# Altium schematic sheet projet_pcb_nucleo_g431.SchDoc
size A2
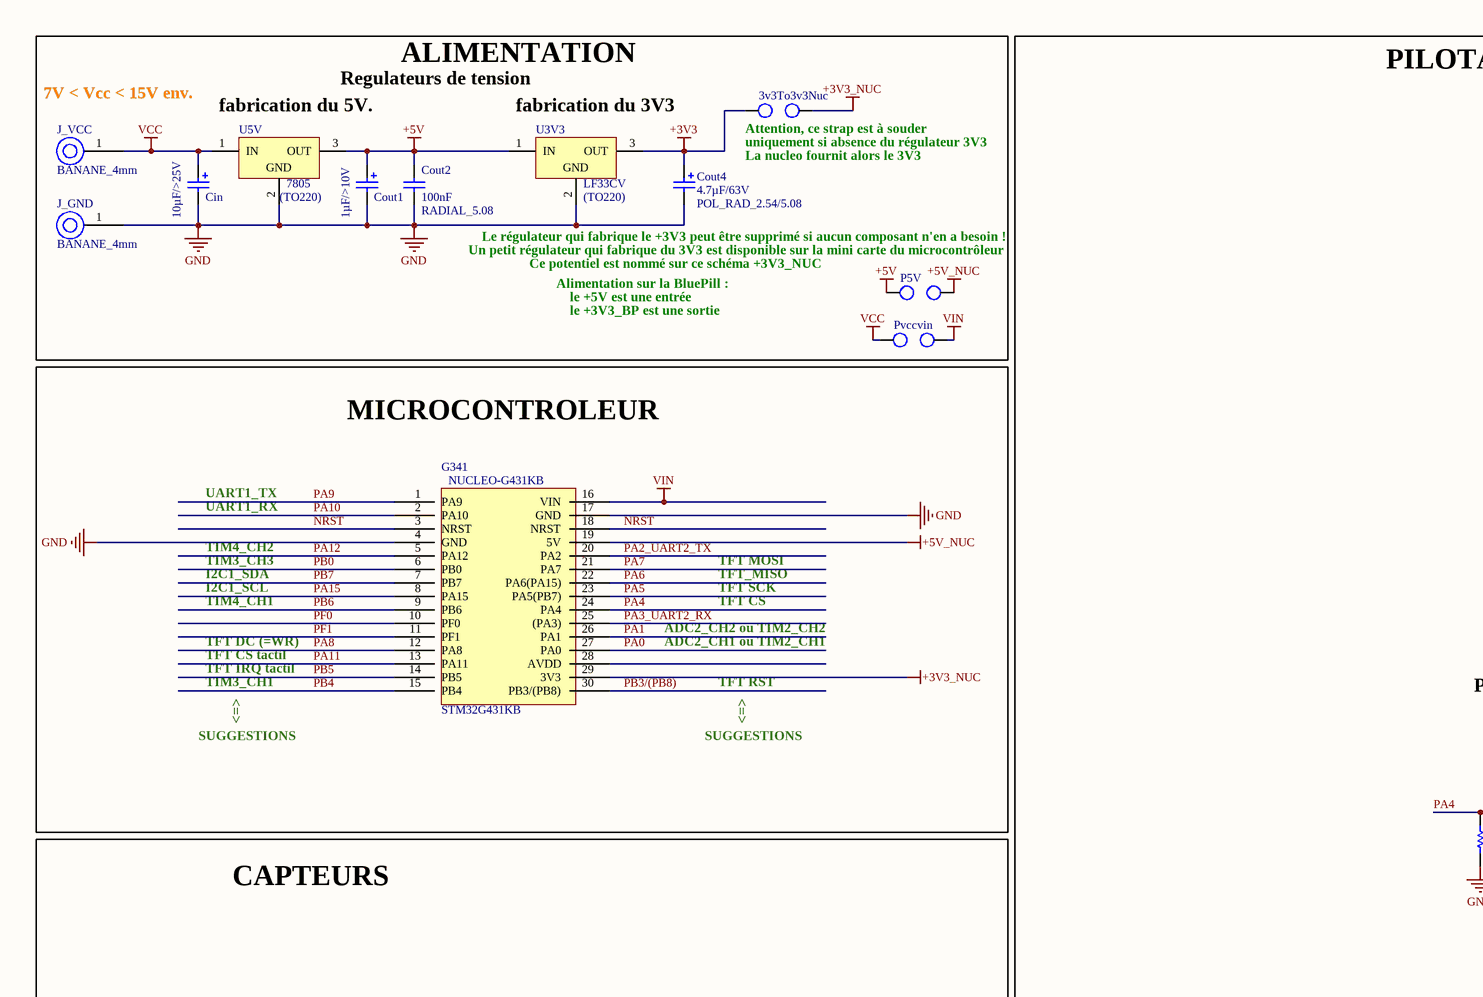
[diagram p0: projet_pcb_nucleo_g431.SchDoc, left]
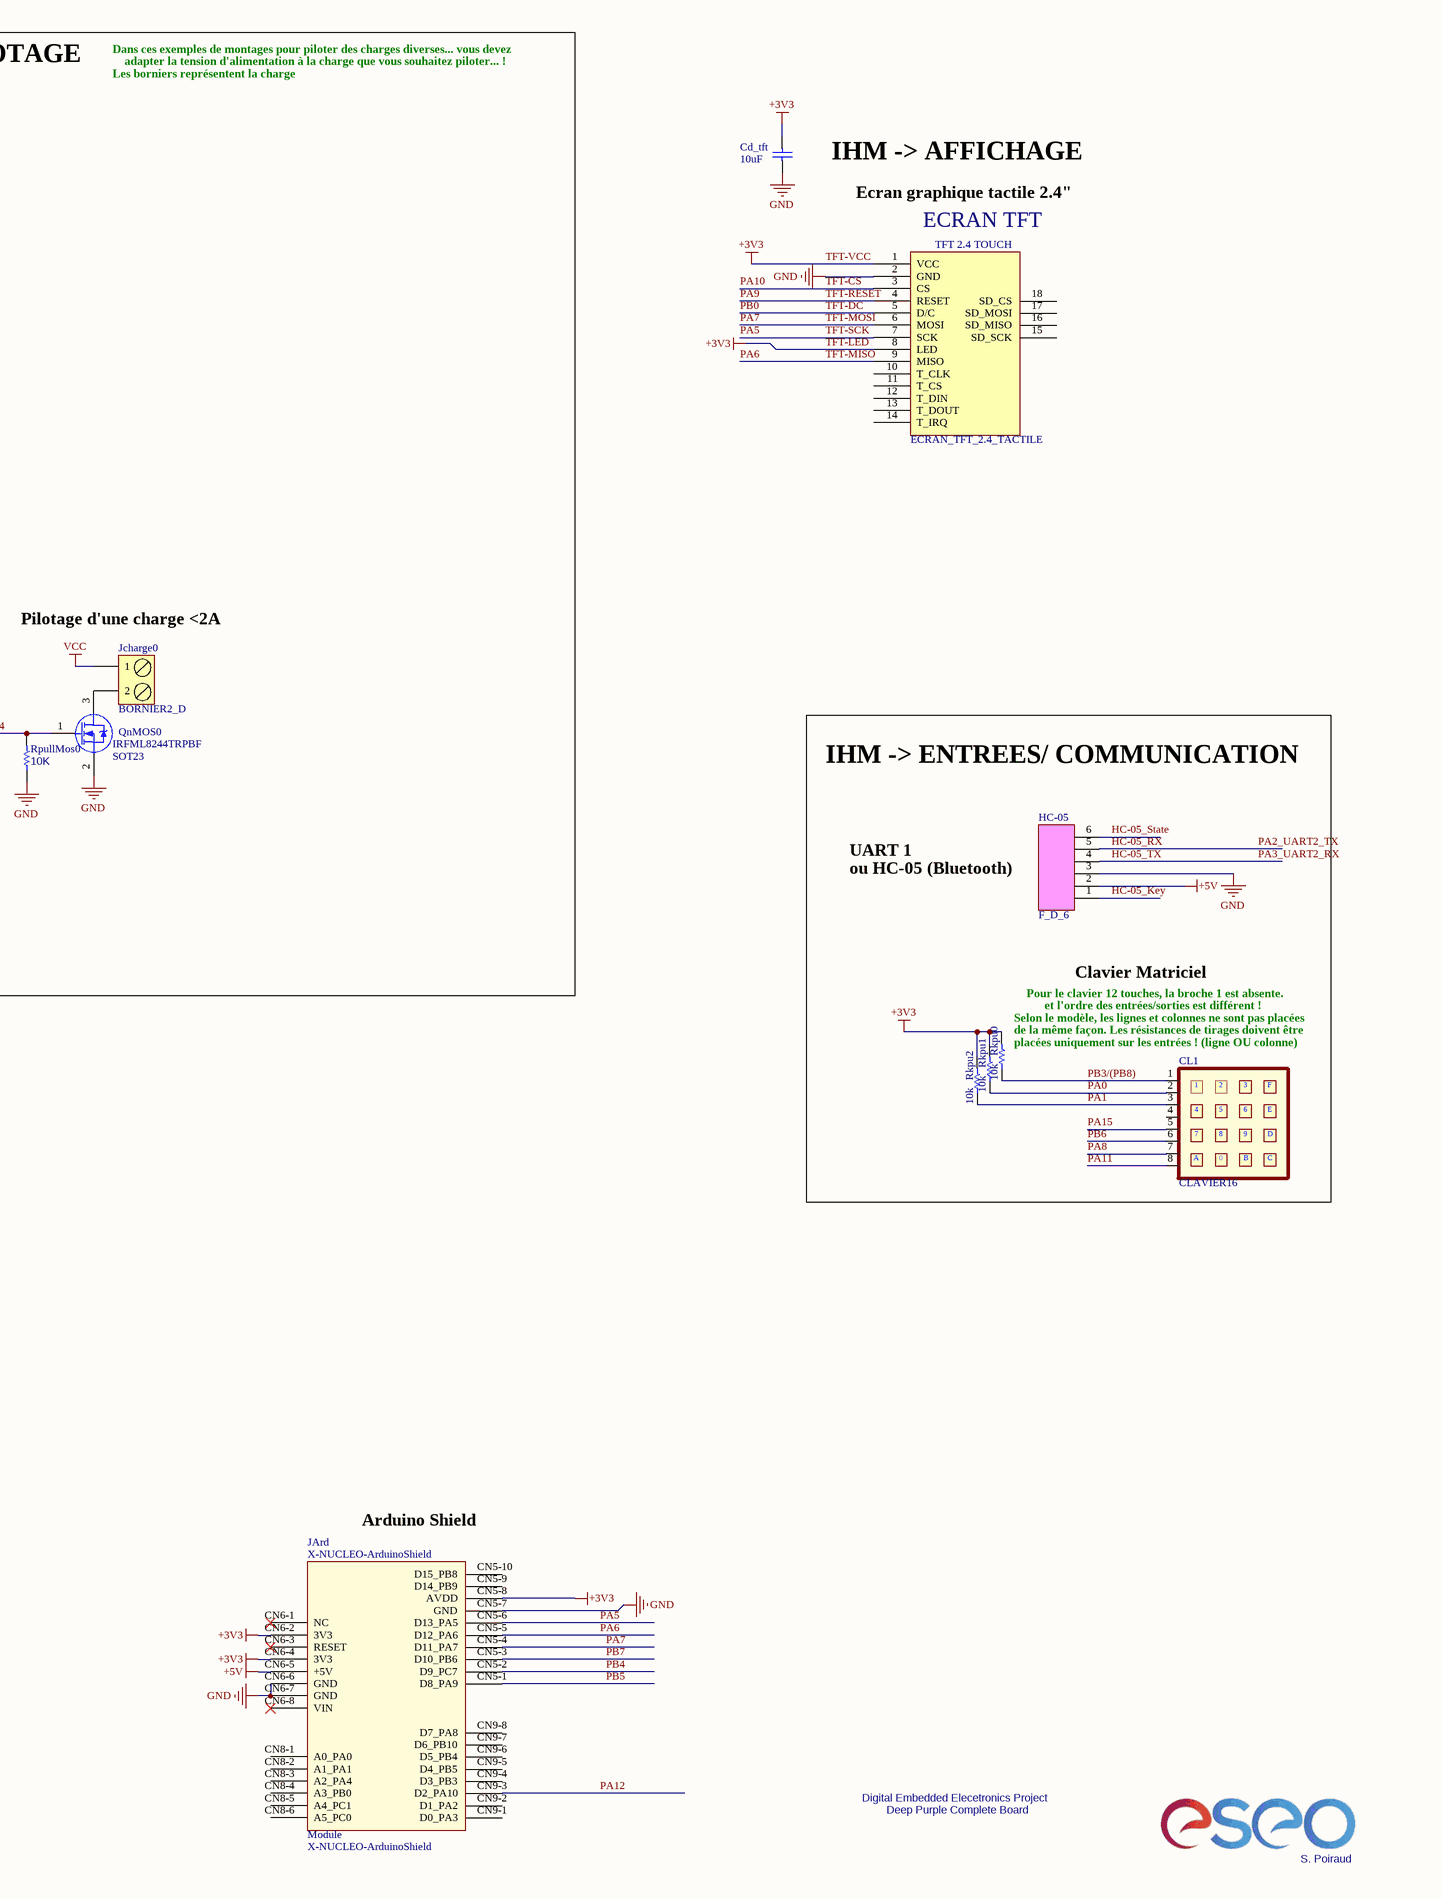
[diagram p1: projet_pcb_nucleo_g431.SchDoc, right]

## Parts
3v3To3v3Nuc  JUMPER2  [BARRETTE_2_M_D]  (value not drawn)
Cd_tft  10uF  [C0805_N]
Cin  value 10µF/>25V  [CONDENSATEUR_POLARISE_ELECTROLYTIQUE_RADIAL_2.0/5.08]  (hidden comment: CONDENSATEUR_POL_ELECTROLY_RAD_2.0/5.08)
CL1  Type: CLAVIER16  [CLAVIER_16_TOUCHES]  (hidden comment: CLAVIER_16_TOUCHES)
Cout1  value 1µF/>10V  [CONDENSATEUR_POLARISE_ELECTROLYTIQUE_RADIAL_2.0/5.08]  (hidden comment: CONDENSATEUR_POL_ELECTROLY_RAD_2.0/5.08)
Cout2  value 100nF  Type: RADIAL_5.08  [CONDENSATEUR_CERAMIQUE_RADIAL_5.08]  (hidden comment: CONDENSATEUR_CER_RAD_5.08)
Cout4  value 4.7µF/63V  Type: POL_RAD_2.54/5.08  [CONDENSATEUR_POLARISE_ELECTROLYTIQUE_RADIAL_2.54/5.08]  (hidden comment: CONDENSATEUR_POL_ELECTROLY_RAD_2.54/5.08)
G341  STM32G431KB  [NUCLEO-G431KB]
HC-05  Type: F_D_6  [BARRETTE_6_F_D]  (hidden comment: BARRETTE_6 CONTACTS_1 RANGEE_FEMELLE_DROITE)
J_GND  Type: BANANE_4mm  [DOUILLE_BANANE_4mm]  (hidden comment: DOUILLE BANANE 4mm)
J_VCC  Type: BANANE_4mm  [DOUILLE_BANANE_4mm]  (hidden comment: DOUILLE BANANE 4mm)
JArd  X-NUCLEO-ArduinoShield  [X-NUCLEO-ARDUINO_SHIELD]
Jcharge0  Type: BORNIER2_D  [BORNIER2_A_VIS]  (hidden comment: BORNIER2 DROIT A VIS)
P5V  JUMPER2  [BARRETTE_2_M_D]  (value not drawn)
Pvccvin  JUMPER2  [BARRETTE_2_M_D]  (value not drawn)
QnMOS0  Type: IRFML8244TRPBF  Package: SOT23  [TRANSISTOR_MOSFET-N_SOT23_GSD]  (hidden comment: TRANSISTOR_MOSFET-N_SOT23_GSD)
Rkpu0  value 10k  [RESISTANCE_CMS_1206]  (hidden comment: RESISTANCE_CMS_1206)
Rkpu1  value 10k  [RESISTANCE_CMS_1206]  (hidden comment: RESISTANCE_CMS_1206)
Rkpu2  value 10k  [RESISTANCE_CMS_1206]  (hidden comment: RESISTANCE_CMS_1206)
RpullMos0  value 10K  [R1206_N]  (hidden comment: RESISTANCE_AXIALE_1/4W)
TFT1  ECRAN_TFT_2.4_TACTILE  [ECRAN_TFT_2.4_TACTILE]
U3V3  Type: LF33CV  Package: (TO220)  [REGULATEUR_TO220_78XX]  (hidden comment: REGULATEUR_TO220_78XX)
U5V  Type: 7805  Package: (TO220)  [REGULATEUR_TO220_78XX]  (hidden comment: REGULATEUR_TO220_78XX)

## Blocks framed on the sheet
ALIMENTATION: 3v3To3v3Nuc Cin Cout1 Cout2 Cout4 J_GND J_VCC P5V Pvccvin U3V3 U5V
PILOTAGE: Jcharge0 QnMOS0 RpullMos0
MICROCONTROLEUR: G341
IHM -> ENTREES/ COMMUNICATION: CL1 HC-05 Rkpu0-Rkpu2

## Nets
+3V3_NUC: 3v3To3v3Nuc.2 G341.29(3V3)
+5V: Cout1.1 Cout2.2 HC-05.2 JArd.CN6-5(+5V) P5V.1 U3V3.1(IN) U5V.3(OUT)
+5V_NUC: G341.19(5V) P5V.2
GND: Cd_tft.1 Cin.2 Cout1.2 Cout2.1 Cout4.2 G341.4(GND) G341.17(GND) HC-05.3 J_GND.1 JArd.CN5-7(GND) JArd.CN6-6(GND) JArd.CN6-7(GND) QnMOS0.2(S) RpullMos0.1 TFT1.2(GND) U3V3.2(GND) U5V.2(GND)
TFT-LED: 3v3To3v3Nuc.1 Cd_tft.2 Cout4.1 JArd.CN5-8(AVDD) JArd.CN6-2(3V3) JArd.CN6-4(3V3) Rkpu0.2 Rkpu1.2 Rkpu2.2 TFT1.1(VCC) TFT1.8(LED) U3V3.3(OUT)  [also labelled +3V3, TFT-VCC]
VCC: Cin.1 J_VCC.1 Jcharge0.1 Pvccvin.1 U5V.1(IN)
VIN: G341.16(VIN) Pvccvin.2
HC-05_Key: HC-05.1
HC-05_RX: G341.20(PA2) HC-05.5  [also labelled PA2_UART2_TX]
HC-05_State: HC-05.6
HC-05_TX: G341.25((PA3)) HC-05.4  [also labelled PA3_UART2_RX]
NRST: G341.3(NRST) G341.18(NRST)
PA0: CL1.2 G341.27(PA0) Rkpu1.1
PA1: CL1.3 G341.26(PA1) Rkpu2.1
PA4: G341.24(PA4) QnMOS0.1(G) RpullMos0.2
PA5: G341.23(PA5(PB7)) JArd.CN5-6(D13_PA5) TFT1.7(SCK)  [also labelled TFT-SCK]
PA6: G341.22(PA6(PA15)) JArd.CN5-5(D12_PA6) TFT1.9(MISO)  [also labelled TFT-MISO]
PA7: G341.21(PA7) JArd.CN5-4(D11_PA7) TFT1.6(MOSI)  [also labelled TFT-MOSI]
PA8: CL1.7 G341.12(PA8)
PA9: G341.1(PA9) TFT1.4(RESET)  [also labelled TFT-RESET]
PA10: G341.2(PA10) TFT1.3(CS)  [also labelled TFT-CS]
PA11: CL1.8 G341.13(PA11)
PA12: G341.5(PA12) JArd.CN9-3(D2_PA10)
PA15: CL1.5 G341.8(PA15)
PB0: G341.6(PB0) TFT1.5(D/C)  [also labelled TFT-DC]
PB3/(PB8): CL1.1 G341.30(PB3/(PB8)) Rkpu0.1
PB4: G341.15(PB4) JArd.CN5-2(D9_PC7)
PB5: G341.14(PB5) JArd.CN5-1(D8_PA9)
PB6: CL1.6 G341.9(PB6)
PB7: G341.7(PB7) JArd.CN5-3(D10_PB6)
PF0: G341.10(PF0)
PF1: G341.11(PF1)
NetJcharge0_2: Jcharge0.2 QnMOS0.3(D)

Not connected (* = marked no-connect by the designer): CL1 4; G341 28(AVDD); JArd CN5-9(D14_PB9) CN5-10(D15_PB8) CN6-1(NC)* CN6-3(RESET)* CN6-8(VIN)* CN8-1(A0_PA0) CN8-2(A1_PA1) CN8-3(A2_PA4) CN8-4(A3_PB0) CN8-5(A4_PC1) CN8-6(A5_PC0) CN9-1(D0_PA3) CN9-2(D1_PA2) CN9-4(D3_PB3) CN9-5(D4_PB5) CN9-6(D5_PB4) CN9-7(D6_PB10) CN9-8(D7_PA8); TFT1 10(T_CLK) 11(T_CS) 12(T_DIN) 13(T_DOUT) 14(T_IRQ) 15(SD_SCK) 16(SD_MISO) 17(SD_MOSI) 18(SD_CS)

## Notes on the sheet
- 7V < Vcc < 15V env.
- (near U5V) fabrication du 5V.
- Regulateurs de tension
- (near U3V3) fabrication du 3V3
- Dans ces exemples de montages pour piloter des charges diverses... vous devez
- Les borniers représentent la charge
- adapter la tension d'alimentation à la charge que vous souhaitez piloter... !
- (near 3v3To3v3Nuc) Attention, ce strap est à souder
- (near 3v3To3v3Nuc) uniquement si absence du régulateur 3V3
- La nucleo fournit alors le 3V3
- Le régulateur qui fabrique le +3V3 peut être supprimé si aucun composant n'en a besoin !
- IHM -> AFFICHAGE
- Ecran graphique tactile 2.4"
- Un petit régulateur qui fabrique du 3V3 est disponible sur la mini carte du microcontrôleur
- Ce potentiel est nommé sur ce schéma +3V3_NUC
- Alimentation sur la BluePill :
- le +5V est une entrée
- (near TFT1) ECRAN TFT
- le +3V3_BP est une sortie
- UART1_TX
- UART1_RX
- TIM4_CH2
- TIM3_CH3
- I2C1_SDA
- TFT_MISO
- TFT MOSI
- TFT DC (=WR)
- TIM4_CH1
- I2C1_SCL
- ADC2_CH2 ou TIM2_CH2
- ADC2_CH1 ou TIM2_CH1
- TFT CS
- TFT SCK
- TFT CS tactil
- TFT IRQ tactil
- TIM3_CH1
- TFT RST
- (near Jcharge0) Pilotage d'une charge <2A
- SUGGESTIONS
- <=>
- CAPTEURS
- UART 1
- ou HC-05 (Bluetooth)
- Pour le clavier 12 touches, la broche 1 est absente.
- et l'ordre des entrées/sorties est différent !
- Clavier Matriciel
- (near Rkpu0) Selon le modèle, les lignes et colonnes ne sont pas placées
- (near Rkpu0) de la même façon. Les résistances de tirages doivent être
- (near Rkpu0) placées uniquement sur les entrées ! (ligne OU colonne)
- (near JArd) Arduino Shield
- Digital Embedded Elecetronics Project
- Deep Purple Complete Board
- S. Poiraud
- Title
- Size:
- Date:
- File:
- A2
- Number:
- Time:
- Revision:
- Sheet
- of
- (in symbol CLAVIER_16_TOUCHES) F; E; 9; D; A; 0; B; C
- (in symbol ECRAN_TFT_2.4_TACTILE) TFT 2.4 TOUCH
- (in symbol G431_Nucleo) NUCLEO-G431KB
- (in symbol X-NUCLEO-ArduinoShield) Module

## Library data of the parts
3v3To3v3Nuc P5V Pvccvin = JUMPER2: BARRETTE 2 CONTACTS 1 RANGEE MALE DROITE; Type: JUMPER2
Cd_tft = CONDENSATEUR_CMS_CER_0805: CONDENSATEUR CMS CERAMIQUE 0805; Value: 10µF; Type: Cd_tft
Cin Cout1 = CONDENSATEUR_POL_ELECTROLY_RAD_2.0/5.08: CONDENSATEUR POLARISE ELECTROLYTIQUE RADIAL 2.0/5.08; Type: POL_RAD_2.0/5.08
CL1 = CLAVIER_16_TOUCHES: CLAVIER 16 TOUCHES
Cout2 = CONDENSATEUR_CER_RAD_5.08: CONDENSATEUR TRAVERSANT CERAMIQUE RADIAL 5.08mm
Cout4 = CONDENSATEUR_POL_ELECTROLY_RAD_2.54/5.08: CONDENSATEUR POLARISE ELECTROLYTIQUE RADIAL 2.54/5.08
G341 = G431_Nucleo: The STM32 Nucleo-32 board provides an affordable and flexible way for users to try out new concepts and build prototypes by choosing from the various combinations of performance and power consumption features, provided by the STM32 microcontroller.
HC-05 = BARRETTE_6 CONTACTS_1 RANGEE_FEMELLE_DROITE: BARRETTE 6 CONTACTS 1 RANGEE FEMELLE DROITE
J_GND J_VCC = DOUILLE_BANANE_4mm: DOUILLE BANANE 4 mm
Jcharge0 = BORNIER2_DROIT_A VIS: BORNIER 2 PLOTS DROIT A VIS 5.08mm
QnMOS0 = TRANSISTOR_MOSFET-N_SOT23_GSD: TRANSISTOR MOSFET CANAL N BOITIER SOT23_GSD
Rkpu0-Rkpu2 = RESISTANCE_CMS_1206: RESISTANCE CMS 1206; Type: CMS_1206
RpullMos0 = RESISTANCE_AXIALE_1/4W: RESISTANCE TRAVERSANTE AXIALE 1/4W; Type: 1/4W
U3V3 U5V = REGULATEUR_TO220_78XX: REGULATEUR DE TENSION POSITIVE 78XX BOITIER TO220